# EAGLE schematic gate433 (EAGLE 7.6.0)

## Sheet 1 of 2: Alap
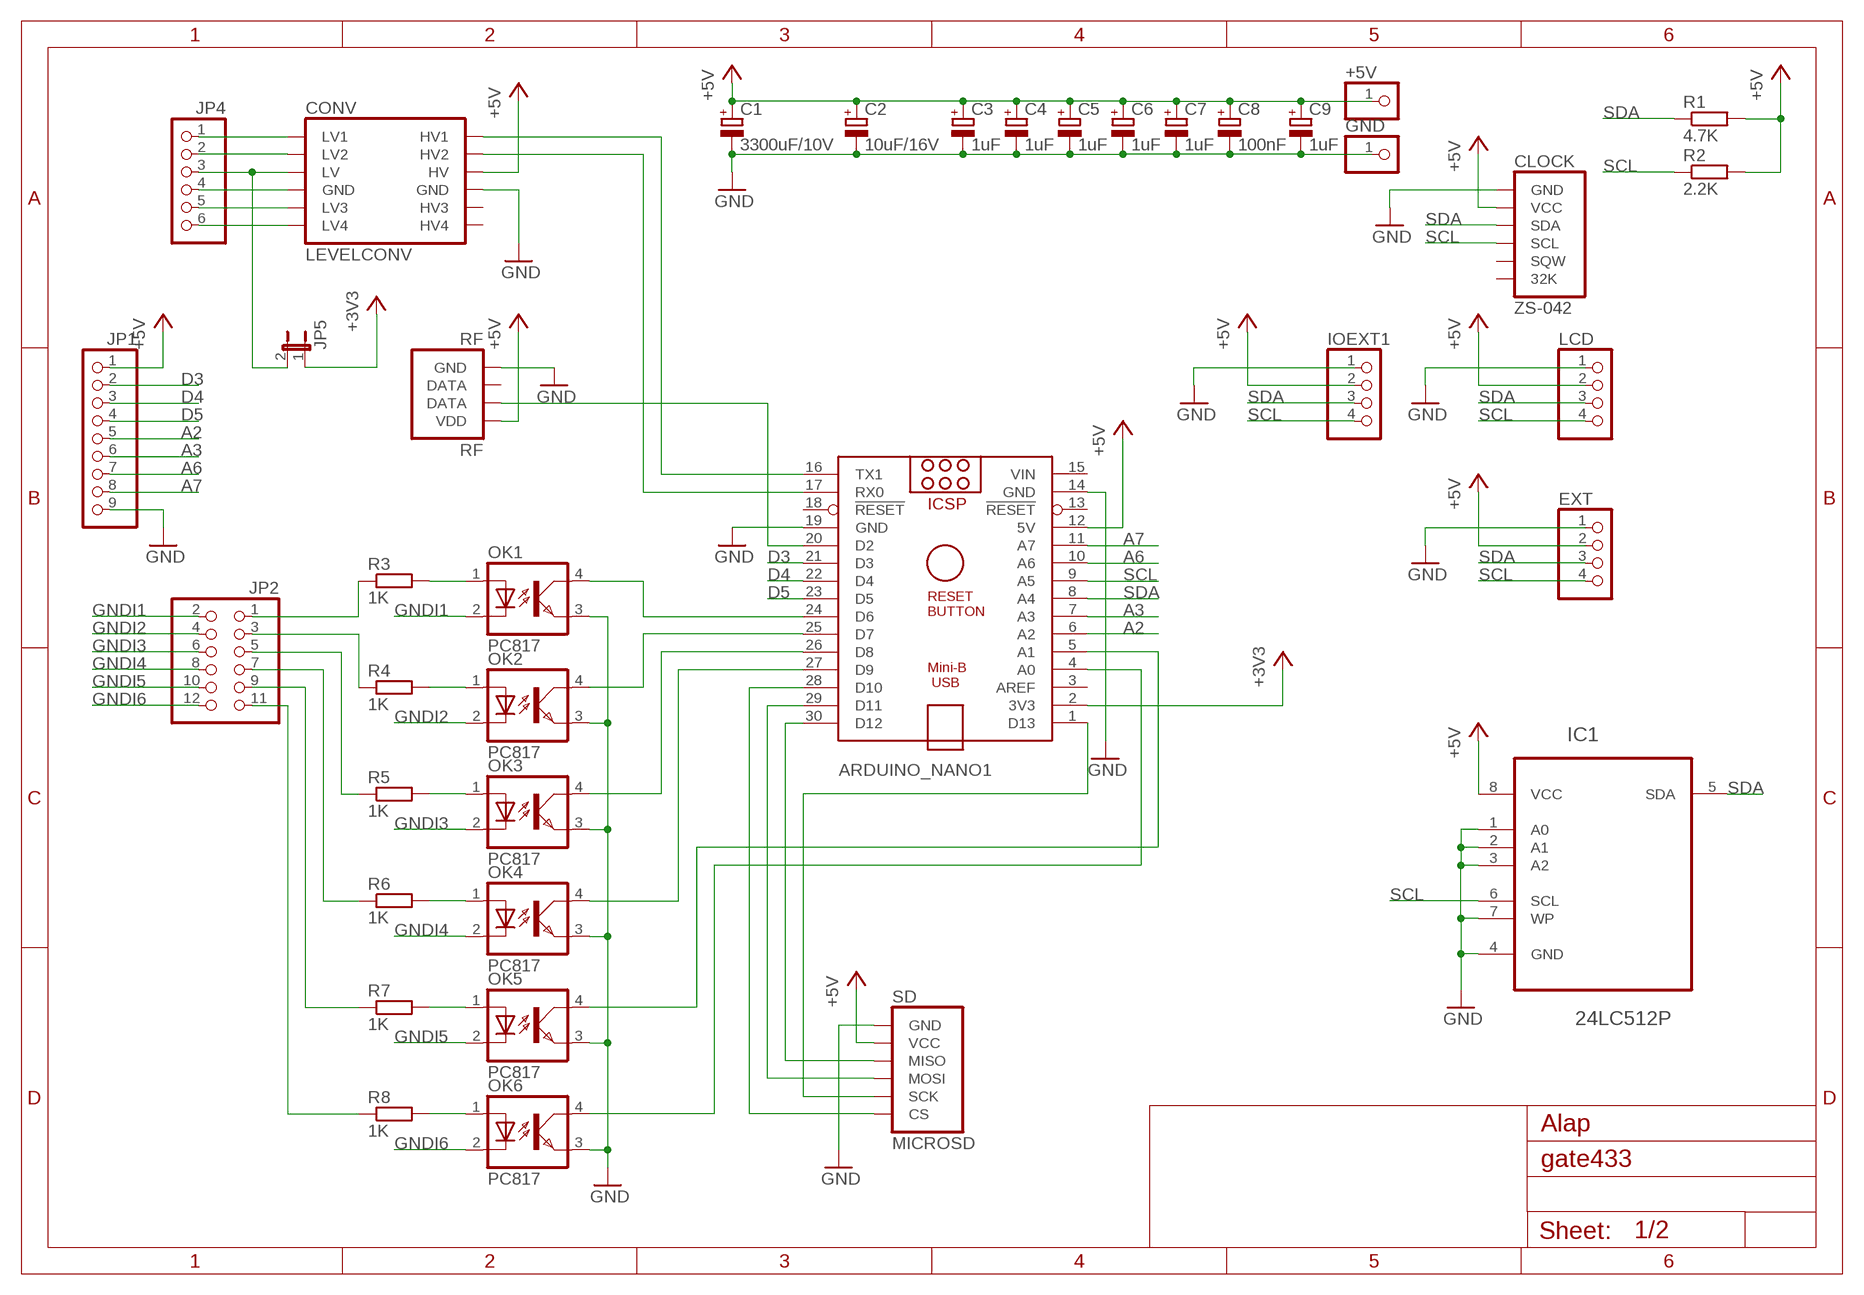
[diagram p0: schematic, sheet 1]

### Parts
+5V  PINHD-1X1  [1X01]
ARDUINO_NANO1  ARDUINO_NANO  [ARDUINO_NANO]
C1  3300uF/10V  CPOL-EUE5-10.5  [E5-10,5]
C2  10uF/16V  CPOL-EUTT2D4  [TT2D4]
C3  1uF  CPOL-EUTT2D4  [TT2D4]
C4  1uF  CPOL-EUTT2D4  [TT2D4]
C5  1uF  CPOL-EUTT2D4  [TT2D4]
C6  1uF  CPOL-EUTT2D4  [TT2D4]
C7  1uF  CPOL-EUTT2D4  [TT2D4]
C8  100nF  CPOL-EUTT2D4  [TT2D4]
C9  1uF  CPOL-EUTT2D4  [TT2D4]
CLOCK  ZS-042  [ZS-042]
CONV  LEVELCONV  [LEVELCONV]
EXT  PINHD-1X4  [1X04]
GND  PINHD-1X1  [1X01]
IC1  24LC512P  AT24C512B-PU25  [DIP254P762X533-8]
IOEXT1  PINHD-1X4  [1X04]
JP1  PINHD-1X9  [1X09]
JP2  PINHD-2X6  [2X06]
JP4  PINHD-1X6  [1X06]
JP5  JP1E  [JP1]
LCD  PINHD-1X4  [1X04]
OK1  PC817  [DIL04]
OK2  PC817  [DIL04]
OK3  PC817  [DIL04]
OK4  PC817  [DIL04]
OK5  PC817  [DIL04]
OK6  PC817  [DIL04]
R1  4.7K  R-EU_0204_7  [0204/7]
R2  2.2K  R-EU_0204_7  [0204/7]
R3  1K  R-EU_0204_7  [0204/7]
R4  1K  R-EU_0204_7  [0204/7]
R5  1K  R-EU_0204_7  [0204/7]
R6  1K  R-EU_0204_7  [0204/7]
R7  1K  R-EU_0204_7  [0204/7]
R8  1K  R-EU_0204_7  [0204/7]
RF  RF  [RF]
SD  MICROSD  [MICROSD]

### Nets
+3V3: ARDUINO_NANO1.2(3V3) JP5.1
+5V: +5V.1 ARDUINO_NANO1.12(5V) C1.+ C2.+ C3.+ C4.+ C5.+ C6.+ C7.+ C8.+ C9.+ CLOCK.2(VCC) CONV.10(HV) EXT.2 IC1.8(VCC) IOEXT1.2 JP1.1 LCD.2 R1.2 R2.2 RF.4(VDD) SD.2(VCC)
A2: ARDUINO_NANO1.6(A2) JP1.5
A3: ARDUINO_NANO1.7(A3) JP1.6
A6: ARDUINO_NANO1.10(A6) JP1.7
A7: ARDUINO_NANO1.11(A7) JP1.8
D3: ARDUINO_NANO1.21(D3) JP1.2
D4: ARDUINO_NANO1.22(D4) JP1.3
D5: ARDUINO_NANO1.23(D5) JP1.4
GND: ARDUINO_NANO1.14(GND) ARDUINO_NANO1.19(GND) C1.- C2.- C3.- C4.- C5.- C6.- C7.- C8.- C9.- CLOCK.1(GND) CONV.9(GND) EXT.1 GND.1 IC1.1(A0) IC1.2(A1) IC1.3(A2) IC1.4(GND) IC1.7(WP) IOEXT1.1 JP1.9 LCD.1 OK1.3(EMIT) OK2.3(EMIT) OK3.3(EMIT) OK4.3(EMIT) OK5.3(EMIT) OK6.3(EMIT) RF.1(GND) SD.1(GND)
GNDI1: JP2.2 OK1.2(C)
GNDI2: JP2.4 OK2.2(C)
GNDI3: JP2.6 OK3.2(C)
GNDI4: JP2.8 OK4.2(C)
GNDI5: JP2.10 OK5.2(C)
GNDI6: JP2.12 OK6.2(C)
N$1: CONV.1(LV1) JP4.1
N$2: JP2.11 R8.1
N$3: OK1.1(A) R3.2
N$4: ARDUINO_NANO1.27(D9) OK4.4(COL)
N$5: ARDUINO_NANO1.26(D8) OK3.4(COL)
N$6: ARDUINO_NANO1.25(D7) OK2.4(COL)
N$7: JP2.9 R7.1
N$8: CONV.2(LV2) JP4.2
N$9: CONV.3(LV) JP4.3 JP5.2
N$10: CONV.5(LV3) JP4.5
N$11: CONV.6(LV4) JP4.6
N$12: CONV.4(GND) JP4.4
N$14: ARDUINO_NANO1.28(D10) SD.6(CS)
N$15: ARDUINO_NANO1.1(D13) SD.5(SCK)
N$16: ARDUINO_NANO1.29(D11) SD.4(MOSI)
N$17: ARDUINO_NANO1.30(D12) SD.3(MISO)
N$18: ARDUINO_NANO1.24(D6) OK1.4(COL)
N$19: JP2.1 R3.1
N$28: JP2.3 R4.1
N$29: ARDUINO_NANO1.4(A0) OK6.4(COL)
N$30: ARDUINO_NANO1.5(A1) OK5.4(COL)
N$33: ARDUINO_NANO1.20(D2) RF.3(DATA)
N$36: JP2.5 R5.1
N$37: JP2.7 R6.1
N$38: OK2.1(A) R4.2
N$39: OK3.1(A) R5.2
N$40: OK4.1(A) R6.2
N$41: OK5.1(A) R7.2
N$42: OK6.1(A) R8.2
N$59: ARDUINO_NANO1.16(TX1) CONV.12(HV1)
N$68: ARDUINO_NANO1.17(RX0) CONV.11(HV2)
SCL: ARDUINO_NANO1.9(A5) CLOCK.4(SCL) EXT.4 IC1.6(SCL) IOEXT1.4 LCD.4 R2.1
SDA: ARDUINO_NANO1.8(A4) CLOCK.3(SDA) EXT.3 IC1.5(SDA) IOEXT1.3 LCD.3 R1.1
Unconnected: ARDUINO_NANO1.3(AREF) ARDUINO_NANO1.13(!RESET) ARDUINO_NANO1.18(!RESET) CLOCK.5(SQW) CLOCK.6(32K) CONV.7(HV4) CONV.8(HV3) RF.2(DATA)

## Sheet 2 of 2: Kimenet
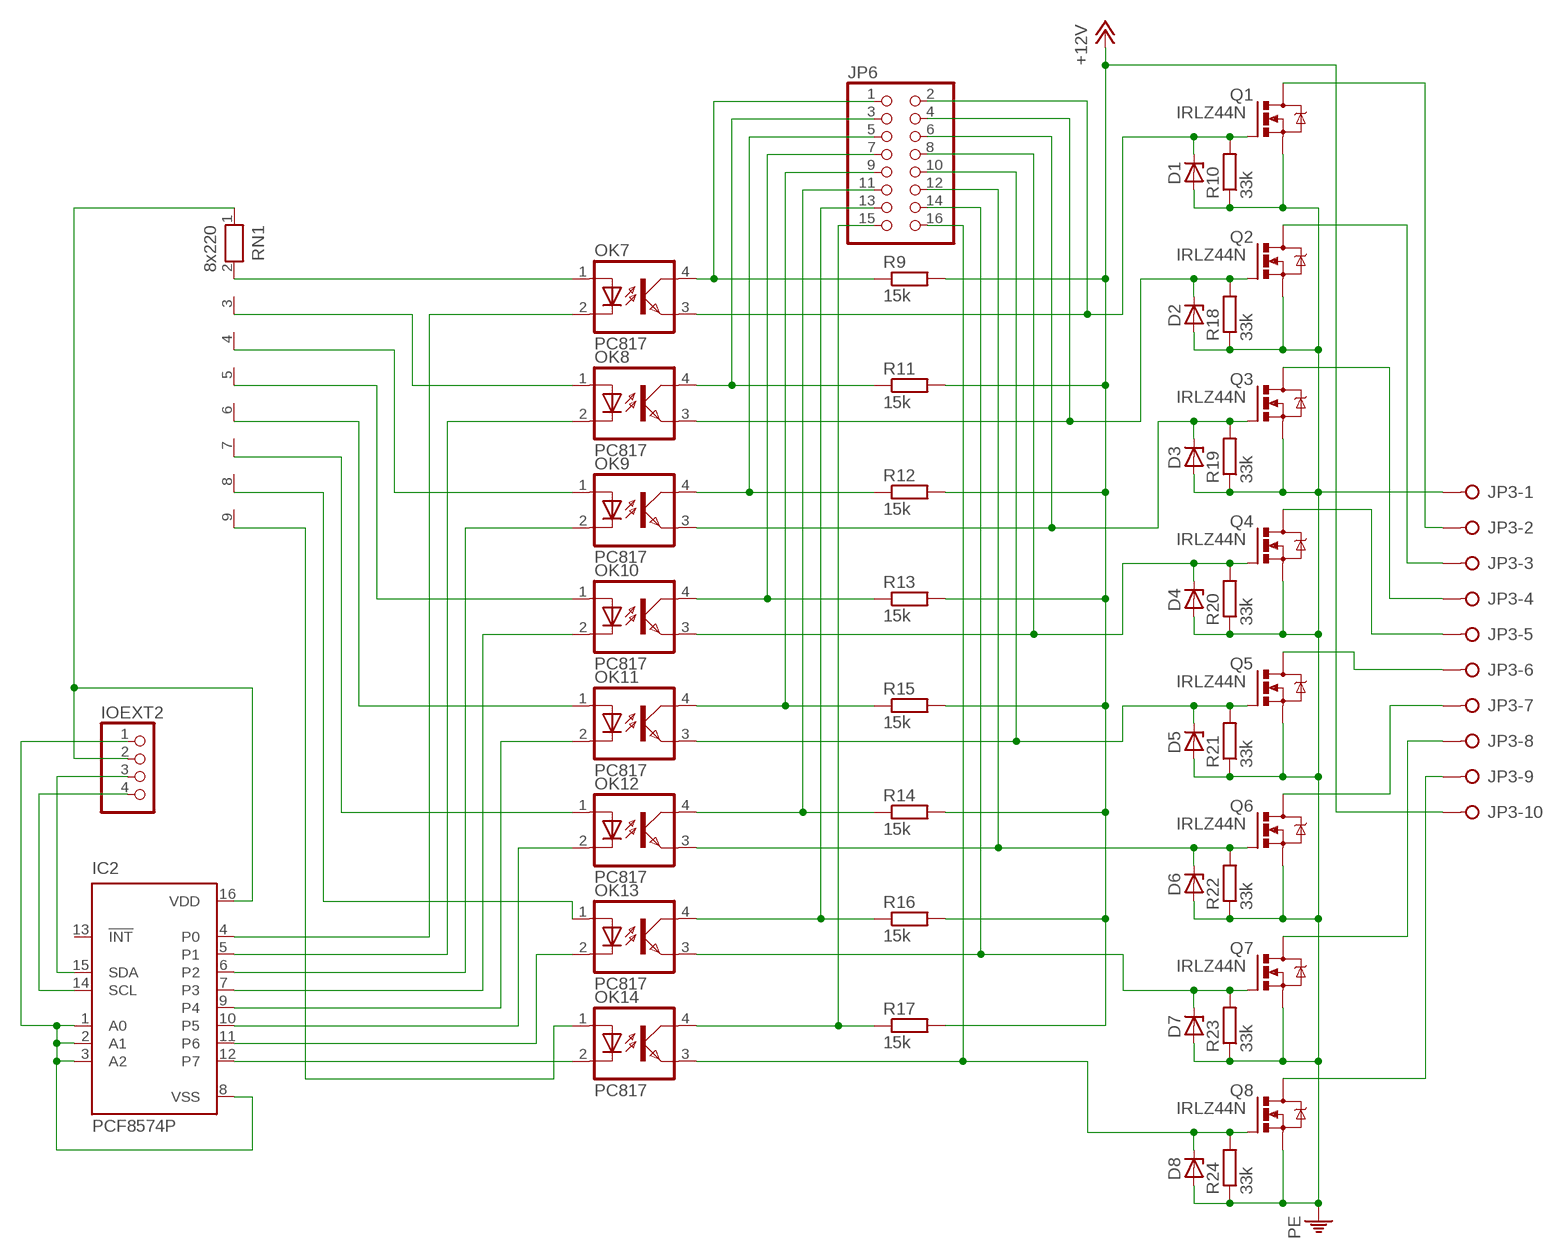
[diagram p1: schematic, sheet 2]

### Parts
D1  ZENER-DIODEZD-5  [ZDIO-5]
D2  ZENER-DIODEZD-5  [ZDIO-5]
D3  ZENER-DIODEZD-5  [ZDIO-5]
D4  ZENER-DIODEZD-5  [ZDIO-5]
D5  ZENER-DIODEZD-5  [ZDIO-5]
D6  ZENER-DIODEZD-5  [ZDIO-5]
D7  ZENER-DIODEZD-5  [ZDIO-5]
D8  ZENER-DIODEZD-5  [ZDIO-5]
IC2  PCF8574P  [DIL16]
IOEXT2  PINHD-1X4  [1X04]
JP3  W237-10P  [W237-10P]
JP6  PINHD-2X8  [2X08]
OK7  PC817  [DIL04]
OK8  PC817  [DIL04]
OK9  PC817  [DIL04]
OK10  PC817  [DIL04]
OK11  PC817  [DIL04]
OK12  PC817  [DIL04]
OK13  PC817  [DIL04]
OK14  PC817  [DIL04]
Q1  IRLZ44N  [TO220BH]
Q2  IRLZ44N  [TO220BH]
Q3  IRLZ44N  [TO220BH]
Q4  IRLZ44N  [TO220BH]
Q5  IRLZ44N  [TO220BH]
Q6  IRLZ44N  [TO220BH]
Q7  IRLZ44N  [TO220BH]
Q8  IRLZ44N  [TO220BH]
R9  15k  R-EU_0204_7  [0204/7]
R10  33k  R-EU_0204_7  [0204/7]
R11  15k  R-EU_0204_7  [0204/7]
R12  15k  R-EU_0204_7  [0204/7]
R13  15k  R-EU_0204_7  [0204/7]
R14  15k  R-EU_0204_7  [0204/7]
R15  15k  R-EU_0204_7  [0204/7]
R16  15k  R-EU_0204_7  [0204/7]
R17  15k  R-EU_0204_7  [0204/7]
R18  33k  R-EU_0204_7  [0204/7]
R19  33k  R-EU_0204_7  [0204/7]
R20  33k  R-EU_0204_7  [0204/7]
R21  33k  R-EU_0204_7  [0204/7]
R22  33k  R-EU_0204_7  [0204/7]
R23  33k  R-EU_0204_7  [0204/7]
R24  33k  R-EU_0204_7  [0204/7]
RN1  8x220  RN08  [RN-9]

### Nets
+12V: R9.2 R11.2 R12.2 R13.2 R14.2 R15.2 R16.2 R17.2
N$13: OK7.1(A) RN1.2
N$20: JP3.2 Q1.D
N$21: JP6.1 OK7.4(COL) R9.1
N$22: JP6.3 OK8.4(COL) R11.1
N$23: JP6.5 OK9.4(COL) R12.1
N$24: JP6.7 OK10.4(COL) R13.1
N$25: JP6.9 OK11.4(COL) R15.1
N$26: JP6.11 OK12.4(COL) R14.1
N$27: JP6.13 OK13.4(COL) R16.1
N$31: IC2.12(P7) OK14.2(C)
N$32: IC2.11(P6) OK13.2(C)
N$34: IC2.10(P5) OK12.2(C)
N$35: IC2.9(P4) OK11.2(C)
N$43: IC2.7(P3) OK10.2(C)
N$44: IC2.6(P2) OK9.2(C)
N$45: IC2.5(P1) OK8.2(C)
N$46: IC2.4(P0) OK7.2(C)
N$47: OK8.1(A) RN1.3
N$48: OK9.1(A) RN1.4
N$49: OK10.1(A) RN1.5
N$50: OK11.1(A) RN1.6
N$51: OK12.1(A) RN1.7
N$52: OK13.1(A) RN1.8
N$53: OK14.1(A) RN1.9
N$54: D1.C JP6.2 OK7.3(EMIT) Q1.G R10.2
N$55: IC2.15(SDA) IOEXT2.3
N$56: JP6.15 OK14.4(COL) R17.1
N$57: D2.C JP6.4 OK8.3(EMIT) Q2.G R18.2
N$58: JP3.10
N$60: D3.C JP6.6 OK9.3(EMIT) Q3.G R19.2
N$61: D4.C JP6.8 OK10.3(EMIT) Q4.G R20.2
N$62: D5.C JP6.10 OK11.3(EMIT) Q5.G R21.2
N$63: D6.C JP6.12 OK12.3(EMIT) Q6.G R22.2
N$64: IC2.14(SCL) IOEXT2.4
N$65: D7.C JP6.14 OK13.3(EMIT) Q7.G R23.2
N$66: D8.C JP6.16 OK14.3(EMIT) Q8.G R24.2
N$67: JP3.3 Q2.D
N$69: IC2.16(VDD) IOEXT2.2 RN1.1
N$71: IC2.1(A0) IC2.2(A1) IC2.3(A2) IC2.8(VSS) IOEXT2.1
N$72: JP3.4 Q3.D
N$77: JP3.5 Q4.D
N$81: JP3.6 Q5.D
N$85: JP3.7 Q6.D
N$89: JP3.8 Q7.D
N$93: JP3.9 Q8.D
PE: D1.A D2.A D3.A D4.A D5.A D6.A D7.A D8.A JP3.1 Q1.S Q2.S Q3.S Q4.S Q5.S Q6.S Q7.S Q8.S R10.1 R18.1 R19.1 R20.1 R21.1 R22.1 R23.1 R24.1
Unconnected: IC2.13(!INT)

## Power pins joined to a net without a drawn wire
VIN: ARDUINO_NANO1.15(VIN)

## Library data of the parts
+5V GND = gate433:PINHD-1X1: PIN HEADER
ARDUINO_NANO1 = ArduinoNanoV30:ARDUINO_NANO: Arduino Nano V3.0 Overview: The Arduino Nano is a small, complete, and breadboard-friendly board based on the ATmega328 (Arduino Nano 3.x) or ATmega168 (Arduino Nano 2.x). It has more or less the same functionality of the Arduino Duemilanove, but in a different package. It lacks only a DC power jack, and works with a Mini-B USB cable instead of a standard one. The Nano was designed and is being produced by Gravitech. Specifications: Microcontroller Atmel ATmega168 or ATmega328 Operating Voltage (logic level) 5 V Input Voltage (recommended) 7-12 V Input Voltage (limits) 6-20 V Digital I/O Pins 14 (of which 6 provide PWM output) Analog Input Pins 8 DC Current per I/O Pin 40 mA Flash Memory 16 KB (ATmega168) or 32 KB (ATmega328) of which 2 KB used by bootloader SRAM 1 KB (ATmega168) or 2 KB (ATmega328) EEPROM 512 bytes (ATmega168) or 1 KB (ATmega328) Clock Speed 16 MHz Dimensions 0.73" x 1.70" Length 45 mm Width 18 mm Weigth 5 g Power: The Arduino Nano can be powered via the Mini-B USB connection, 6-20V unregulated external power supply (pin 30), or 5V regulated external power supply (pin 27). The power source is automatically selected to the highest voltage source. Memory: The ATmega168 has 16 KB of flash memory for storing code (of which 2 KB is used for the bootloader); the ATmega328 has 32 KB, (also with 2 KB used for the bootloader). The ATmega168 has 1 KB of SRAM and 512 bytes of EEPROM (which can be read and written with the EEPROM library); the ATmega328 has 2 KB of SRAM and 1 KB of EEPROM. Input and Output: Each of the 14 digital pins on the Nano can be used as an input or output, using pinMode(), digitalWrite(), and digitalRead() functions. They operate at 5 volts. Each pin can provide or receive a maximum of 40 mA and has an internal pull-up resistor (disconnected by default) of 20-50 kOhms. In addition, some pins have specialized functions. Visit Arduino - ArduinoBoardNano <https://www.arduino.cc/en/Main/ArduinoBoardNano>
C1-C9 = resistor:CPOL-EU: POLARIZED CAPACITOR, European symbol
CLOCK = gate433:ZS-042
CONV = gate433:LEVELCONV
D1-D8 = gate433:ZENER-DIODE: Z-Diode
EXT IOEXT1 IOEXT2 LCD = gate433:PINHD-1X4: PIN HEADER
IC1 = gate433:AT24C512B-PU25: Two-wire Serial EEPROM; MPN: AT24C512B-PU25; OC_FARNELL: 1362655; OC_NEWARK: -; PACKAGE: PDIP-8; SUPPLIER: Atmel
IC2 = gate433:PCF8574: I2C-Bus Remote 8-bit I/O expander http://www.semiconductors.philips.com/acrobat_download/datasheets/PCF8574_4.pdf; MPN: PCF8574PN; OC_FARNELL: 204020; OC_NEWARK: 11N8515
JP1 = gate433:PINHD-1X9: PIN HEADER
JP2 = gate433:PINHD-2X6: PIN HEADER
JP3 = gate433:W237-10P: WAGO SREW CLAMP; OC_FARNELL: unknown; OC_NEWARK: unknown
JP4 = gate433:PINHD-1X6: PIN HEADER
JP5 = gate433:JP1E: JUMPER
JP6 = gate433:PINHD-2X8: PIN HEADER
OK1-OK14 = gate433:PC817: SHARP OPTO COUPLER; MPN: PC817X4J000F; OC_FARNELL: 9707727; OC_NEWARK: 97K7059
Q1-Q8 = gate433:IRLZ44N: N-Channel HEXFET® Power MOSFET Logic Level AUTOMOTIVE MOSFET Source: http://www.irf.com/product-info/datasheets/data/irlz44n.pdf
R1-R24 = resistor:R-EU_: RESISTOR, European symbol; SPICEPREFIX: R
RF = gate433:RF
RN1 = gate433:RN08: RESISTOR NETWORK; OC_FARNELL: unknown; OC_NEWARK: unknown
SD = gate433:MICROSD